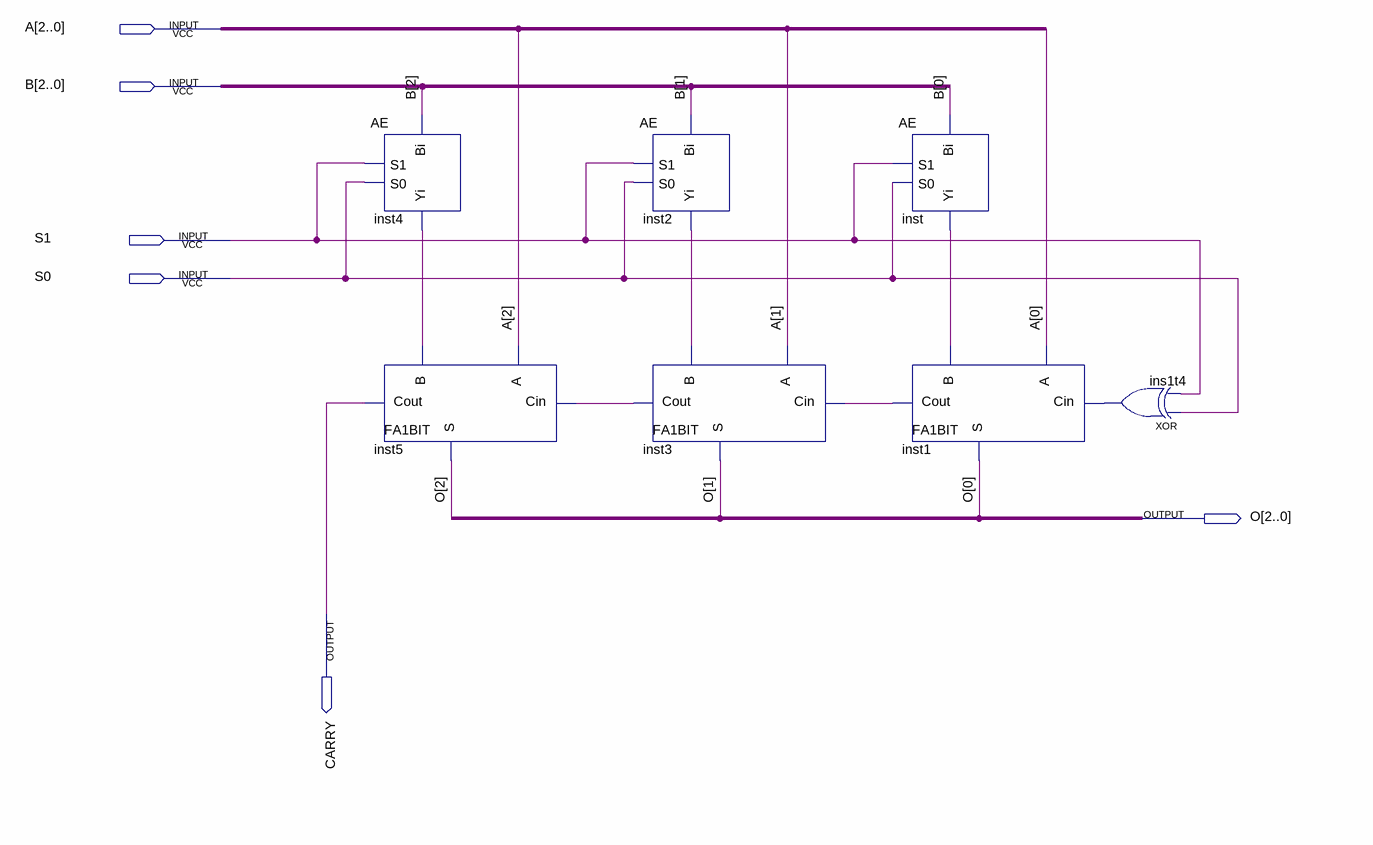
[diagram p0: schematic sheet]
// Quartus schematic TEST.bdf as structural Verilog: 7 symbols, 6 pins
module TEST (
  input  [2:0] A,
  input  [2:0] B,
  input  S1,
  input  S0,
  output [2:0] O,
  output CARRY
);

  wire ins1t4_out, inst1_cout, inst2_yi, inst3_cout, inst4_yi, inst_yi;

  AE inst4 (.Bi(B[2]), .S1(S1), .S0(S0), .Yi(inst4_yi));
  FA1BIT inst5 (.Cin(inst3_cout), .A(A[2]), .B(inst4_yi), .Cout(CARRY), .S(O[2]));
  AE inst2 (.Bi(B[1]), .S1(S1), .S0(S0), .Yi(inst2_yi));
  FA1BIT inst3 (.Cin(inst1_cout), .A(A[1]), .B(inst2_yi), .Cout(inst3_cout), .S(O[1]));
  AE inst (.Bi(B[0]), .S1(S1), .S0(S0), .Yi(inst_yi));
  FA1BIT inst1 (.Cin(ins1t4_out), .A(A[0]), .B(inst_yi), .Cout(inst1_cout), .S(O[0]));
  xor ins1t4 (ins1t4_out, S0, S1);
endmodule
